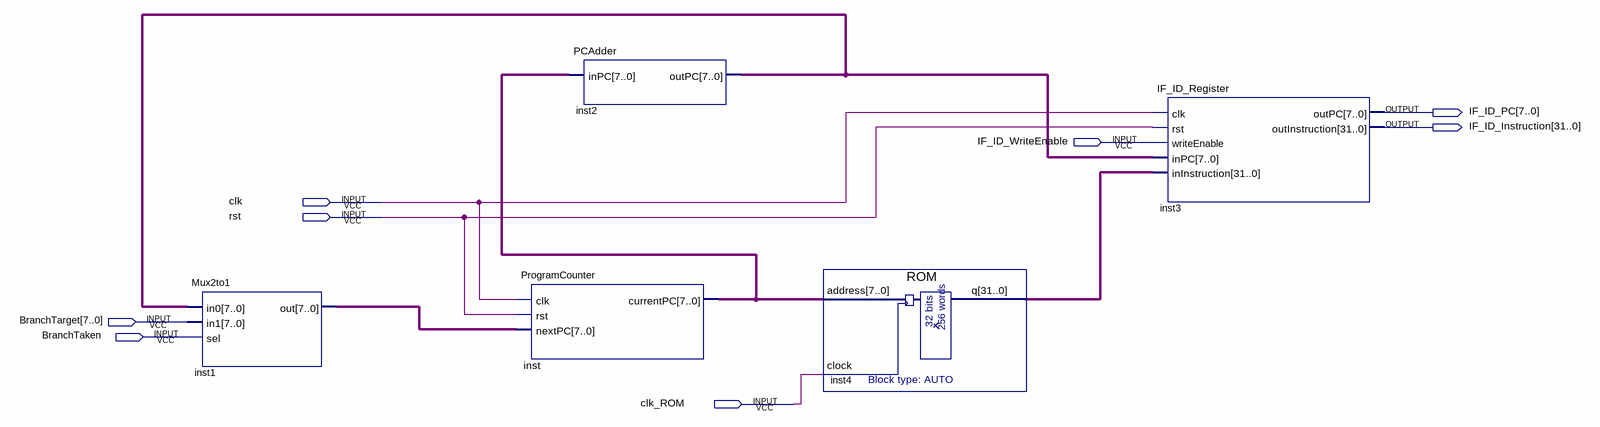
[diagram p0: schematic sheet]
// Quartus schematic IF_STAGE.bdf as structural Verilog: 5 symbols, 8 pins
module IF_STAGE (
  input  IF_ID_WriteEnable,
  input  clk,
  input  rst,
  input  [7:0] BranchTarget,
  input  BranchTaken,
  input  clk_ROM,
  output [7:0] IF_ID_PC,
  output [31:0] IF_ID_Instruction
);

  wire [7:0] inst1_out, inst2_outpc, inst_currentpc;
  wire [31:0] inst4_q;

  Mux2to1 inst1 (.in0(inst2_outpc), .in1(BranchTarget), .sel(BranchTaken), .out(inst1_out));
  ProgramCounter inst (.clk(clk), .rst(rst), .nextPC(inst1_out), .currentPC(inst_currentpc));
  PCAdder inst2 (.inPC(inst_currentpc), .outPC(inst2_outpc));
  ROM inst4 (.address(inst_currentpc), .clock(clk_ROM), .q(inst4_q));
  IF_ID_Register inst3 (
    .clk(clk), .rst(rst), .writeEnable(IF_ID_WriteEnable), .inPC(inst2_outpc), .inInstruction(inst4_q),
    .outPC(IF_ID_PC), .outInstruction(IF_ID_Instruction));
endmodule
